# EAGLE design HELPStat_V2 (EAGLE 9.6.2)
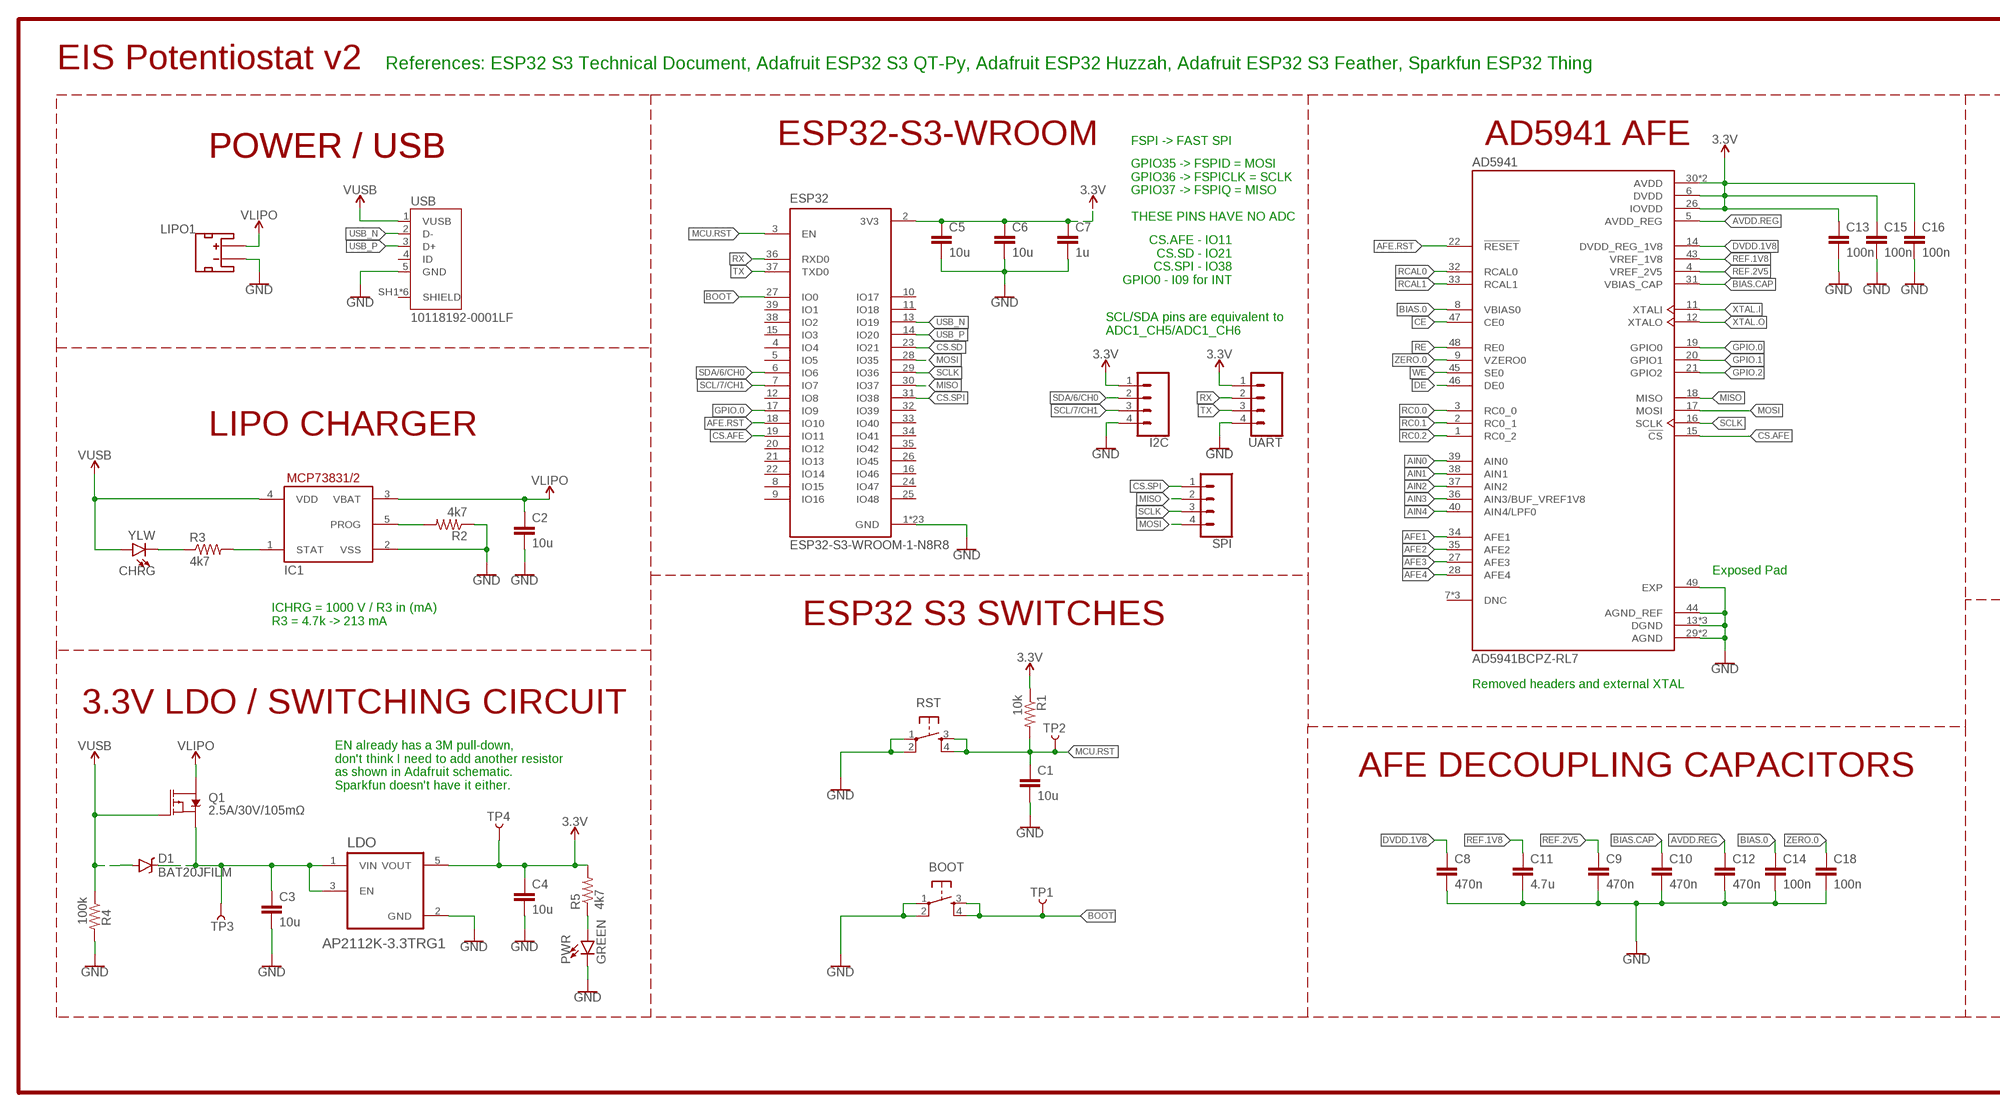
[diagram p0: schematic, sheet 1, part 1 of 2]
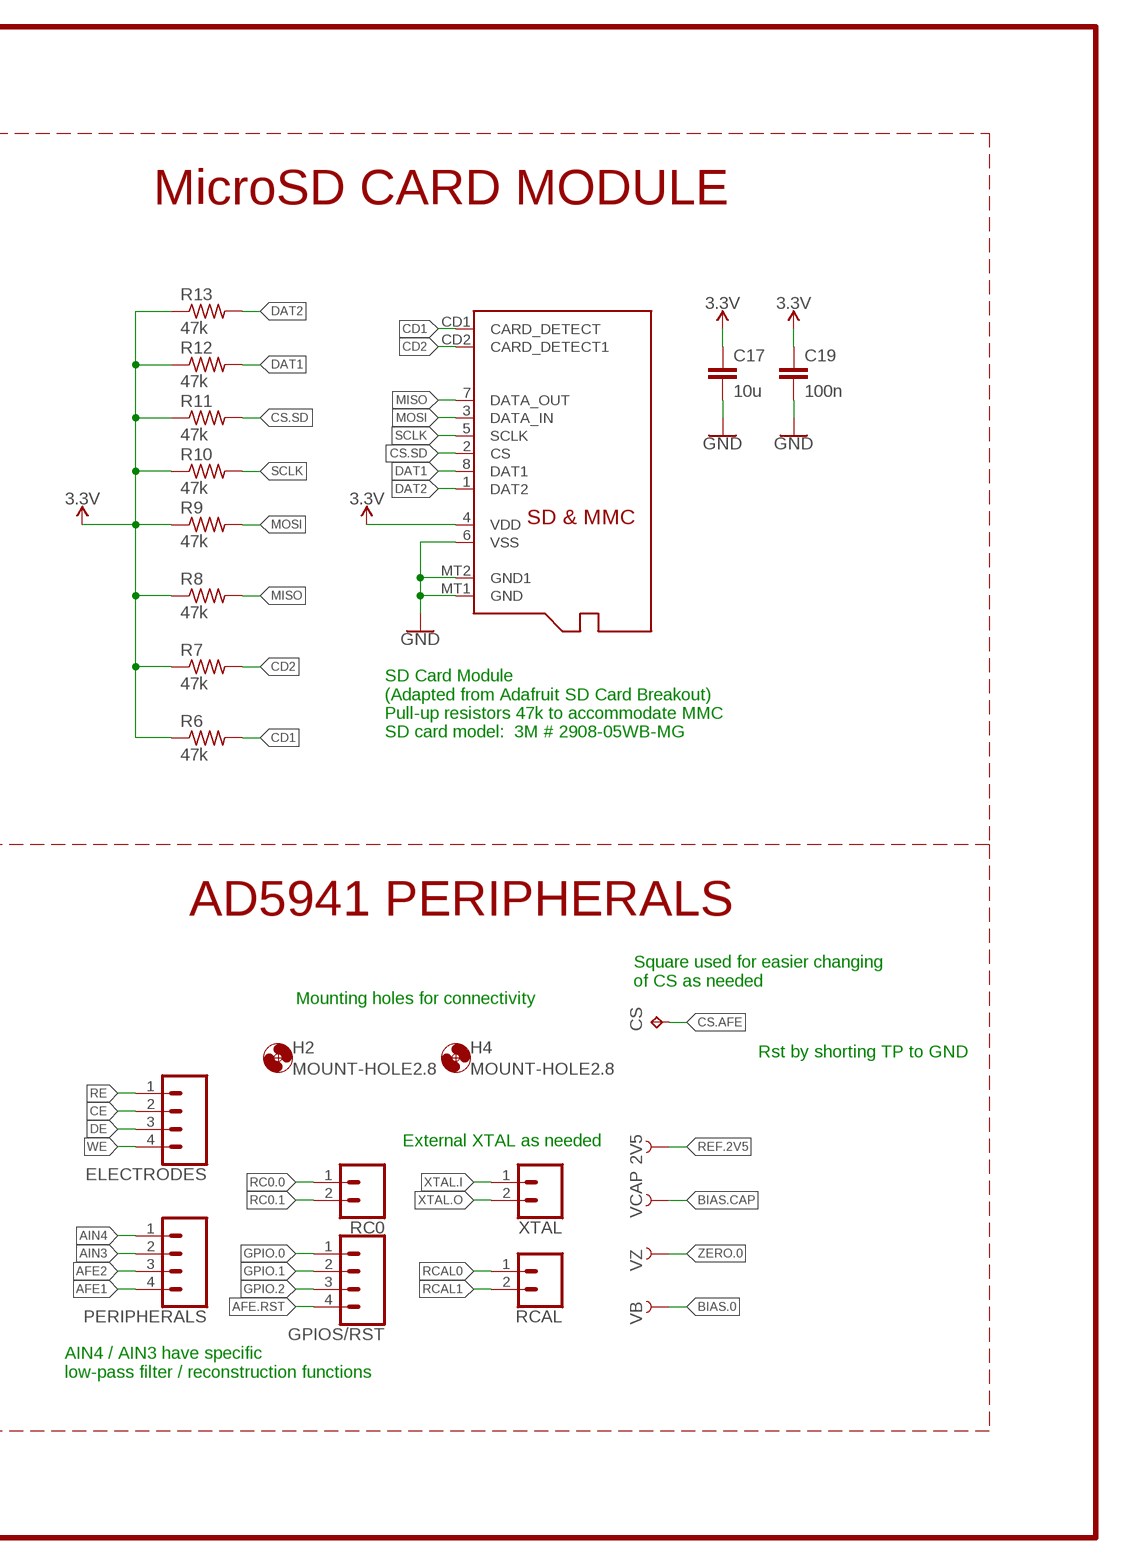
[diagram p1: schematic, sheet 1, part 2 of 2]

## Parts
2V5  TEST-POINT3X5  [PAD.03X.05]
AD5941  AD5941BCPZ-RL7  [QFN50P700X700X80-49N]
BOOT  SPST-PTS830GG140  [BUTTON-GULLWING]
C1  10u  CAPACITOR0402  [C0402]
C2  10u  CAPACITOR0402  [C0402]
C3  10u  CAPACITOR0402  [C0402]
C4  10u  CAPACITOR0402  [C0402]
C5  10u  CAPACITOR0402  [C0402]
C6  10u  CAPACITOR0402  [C0402]
C7  1u  CAPACITOR0402  [C0402]
C8  470n  CAPACITOR0402  [C0402]
C9  470n  CAPACITOR0402  [C0402]
C10  470n  CAPACITOR0402  [C0402]
C11  4.7u  CAPACITOR0402  [C0402]
C12  470n  CAPACITOR0402  [C0402]
C13  100n  CAPACITOR0402  [C0402]
C14  100n  CAPACITOR0402  [C0402]
C15  100n  CAPACITOR0402  [C0402]
C16  100n  CAPACITOR0402  [C0402]
C17  10u  CAPACITOR0402  [C0402]
C18  100n  CAPACITOR0402  [C0402]
C19  100n  CAPACITOR0402  [C0402]
CHRG  YLW  LED0603  [LED-0603]
CS  TPTP20SQ  [TP20SQ]
D1  BAT20JFILM  [SOD-323]
ELECTRODES  CONN_04  [1X04]
ESP32  ESP32-S3-WROOM-1-N8R8  [XCVR_ESP32S3WROOM1N8R8]
GPIOS/RST  CONN_041.27MM  [1X04_1.27MM]
H2  MOUNT-HOLE2.8  [2,8]
H4  MOUNT-HOLE2.8  [2,8]
I2C  CONN_04  [1X04]
IC1  MCP73831/OT  [SOT23-5L]
LDO  AP2112K-3.3TRG1  [SOT95P285X140-5N]
LIPO1  JST_2MM_MALE  [JST-2-SMD]
PERIPHERALS  CONN_041.27MM  [1X04_1.27MM]
PWR  GREEN  LED0603  [LED-0603]
Q1  2.5A/30V/105mΩ  PFET-DMG2307L  [SOT23-3]
R1  10k  RESISTOR0402  [R0402]
R2  4k7  RESISTOR0402  [R0402]
R3  4k7  RESISTOR0402  [R0402]
R4  100k  RESISTOR0603  [R0603]
R5  4k7  RESISTOR0402  [R0402]
R6  47k  RESISTOR0402  [R0402]
R7  47k  RESISTOR0402  [R0402]
R8  47k  RESISTOR0402  [R0402]
R9  47k  RESISTOR0402  [R0402]
R10  47k  RESISTOR0402  [R0402]
R11  47k  RESISTOR0402  [R0402]
R12  47k  RESISTOR0402  [R0402]
R13  47k  RESISTOR0402  [R0402]
RC0  CONN_02.50MIL  [1X02_1.27MM]
RCAL  CONN_02  [1X02]
RST  SPST-PTS830GG140  [BUTTON-GULLWING]
SDCARD  MICROSD  [MICROSD]
SPI  CONN_04  [1X04]
TP1  TEST-POINT3X5  [PAD.03X.05]
TP2  TEST-POINT3X5  [PAD.03X.05]
TP3  TEST-POINT3X5  [PAD.03X.05]
TP4  TEST-POINT3X5  [PAD.03X.05]
UART  CONN_04  [1X04]
USB  10118192-0001LF  [AMPHENOL_10118192-0001LF]
VB  TEST-POINT3X5  [PAD.03X.05]
VCAP  TEST-POINT3X5  [PAD.03X.05]
VZ  TEST-POINT3X5  [PAD.03X.05]
XTAL  CONN_02.50MIL  [1X02_1.27MM]

## Nets
3.3V: AD5941.6(DVDD) AD5941.26(IOVDD) AD5941.30(AVDD) AD5941.41(AVDD) C4.1 C5.1 C6.1 C7.1 C13.1 C15.1 C16.1 C17.1 C19.1 ESP32.2(3V3) I2C.1 LDO.5(VOUT) R1.1 R5.2 R6.1 R7.1 R8.1 R9.1 R10.1 R11.1 R12.1 R13.1 SDCARD.4(VDD) TP4.P$1 UART.1
AFE1: AD5941.34(AFE1) PERIPHERALS.4
AFE2: AD5941.35(AFE2) PERIPHERALS.3
AFE3: AD5941.27(AFE3)
AFE4: AD5941.28(AFE4)
AFE.RST: AD5941.22(!RESET) ESP32.18(IO10) GPIOS/RST.4
AIN0: AD5941.39(AIN0)
AIN1: AD5941.38(AIN1)
AIN2: AD5941.37(AIN2)
AIN3: AD5941.36(AIN3/BUF_VREF1V8) PERIPHERALS.2
AIN4: AD5941.40(AIN4/LPF0) PERIPHERALS.1
AVDD.REG: AD5941.5(AVDD_REG) C12.1
BIAS.0: AD5941.8(VBIAS0) C14.1 VB.P$1
BIAS.CAP: AD5941.31(VBIAS_CAP) C10.1 VCAP.P$1
BOOT: BOOT.3 BOOT.4 ESP32.27(IO0) TP1.P$1
CD1: R6.2 SDCARD.CD1(CARD_DETECT)
CD2: R7.2 SDCARD.CD2(CARD_DETECT1)
CE: AD5941.47(CE0) ELECTRODES.2
CS.AFE: AD5941.15(!CS) CS.TP ESP32.19(IO11)
CS.SD: ESP32.23(IO21) R11.2 SDCARD.2(CS)
CS.SPI: ESP32.31(IO38) SPI.1
DAT1: R12.2 SDCARD.8(DAT1)
DAT2: R13.2 SDCARD.1(DAT2)
DE: AD5941.46(DE0) ELECTRODES.3
DVDD.1V8: AD5941.14(DVDD_REG_1V8) C8.1
GND: AD5941.13(DGND) AD5941.23(DGND) AD5941.25(DGND) AD5941.29(AGND) AD5941.42(AGND) AD5941.44(AGND_REF) AD5941.49(EXP) BOOT.1 BOOT.2 C1.2 C2.2 C3.2 C4.2 C5.2 C6.2 C7.2 C8.2 C9.2 C10.2 C11.2 C12.2 C13.2 C14.2 C15.2 C16.2 C17.2 C18.2 C19.2 ESP32.1(GND) ESP32.40(GND) ESP32.41_1(GND) ESP32.41_2(GND) ESP32.41_3(GND) ESP32.41_4(GND) ESP32.41_5(GND) ESP32.41_6(GND) ESP32.41_7(GND) ESP32.41_8(GND) ESP32.41_9(GND) ESP32.41_10(GND) ESP32.41_11(GND) ESP32.41_12(GND) ESP32.41_13(GND) ESP32.41_14(GND) ESP32.41_15(GND) ESP32.41_16(GND) ESP32.41_17(GND) ESP32.41_18(GND) ESP32.41_19(GND) ESP32.41_20(GND) ESP32.41_21(GND) I2C.4 IC1.2(VSS) LDO.2(GND) LIPO1.1(-) PWR.C R2.1 R4.2 RST.1 RST.2 SDCARD.6(VSS) SDCARD.MT1(GND) SDCARD.MT2(GND1) UART.4 USB.5(GND)
GPIO.0: AD5941.19(GPIO0) ESP32.17(IO9) GPIOS/RST.1
GPIO.1: AD5941.20(GPIO1) GPIOS/RST.2
GPIO.2: AD5941.21(GPIO2) GPIOS/RST.3
MCU.RST: C1.1 ESP32.3(EN) R1.2 RST.3 RST.4 TP2.P$1
MISO: AD5941.18(MISO) ESP32.30(IO37) R8.2 SDCARD.7(DATA_OUT) SPI.2
MOSI: AD5941.17(MOSI) ESP32.28(IO35) R9.2 SDCARD.3(DATA_IN) SPI.4
N$1: CHRG.C R3.1
N$2: IC1.1(STAT) R3.2
N$3: IC1.5(PROG) R2.2
N$4: PWR.A R5.1
N$7: C3.1 D1.C LDO.1(VIN) LDO.3(EN) Q1.2(S) TP3.P$1
RC0.0: AD5941.3(RC0_0) RC0.1
RC0.1: AD5941.2(RC0_1) RC0.2
RC0.2: AD5941.1(RC0_2)
RCAL0: AD5941.32(RCAL0) RCAL.1
RCAL1: AD5941.33(RCAL1) RCAL.2
RE: AD5941.48(RE0) ELECTRODES.1
REF.1V8: AD5941.43(VREF_1V8) C11.1
REF.2V5: 2V5.P$1 AD5941.4(VREF_2V5) C9.1
RX: ESP32.36(RXD0) UART.2
SCL/7/CH1: ESP32.7(IO7) I2C.3
SCLK: AD5941.16(SCLK) ESP32.29(IO36) R10.2 SDCARD.5(SCLK) SPI.3
SDA/6/CH0: ESP32.6(IO6) I2C.2
TX: ESP32.37(TXD0) UART.3
USB_N: ESP32.13(IO19) USB.2(D-)
USB_P: ESP32.14(IO20) USB.3(D+)
V_USB: CHRG.A D1.A IC1.4(VDD) Q1.1(G) R4.1 USB.1(VUSB) ; supply symbol labelled VUSB
VLIPO: C2.1 IC1.3(VBAT) LIPO1.2(+) Q1.3(D)
WE: AD5941.45(SE0) ELECTRODES.4
XTAL.I: AD5941.11(XTALI) XTAL.1
XTAL.O: AD5941.12(XTALO) XTAL.2
ZERO.0: AD5941.9(VZERO0) C18.1 VZ.P$1
Unconnected: AD5941.7(DNC) AD5941.10(DNC) AD5941.24(DNC) ESP32.4(IO4) ESP32.5(IO5) ESP32.8(IO15) ESP32.9(IO16) ESP32.10(IO17) ESP32.11(IO18) ESP32.12(IO8) ESP32.15(IO3) ESP32.16(IO46) ESP32.20(IO12) ESP32.21(IO13) ESP32.22(IO14) ESP32.24(IO47) ESP32.25(IO48) ESP32.26(IO45) ESP32.32(IO39) ESP32.33(IO40) ESP32.34(IO41) ESP32.35(IO42) ESP32.38(IO2) ESP32.39(IO1) LIPO1.NC1(PAD1) LIPO1.NC2(PAD2) USB.4(ID) USB.SH1(SHIELD) USB.SH2(SHIELD) USB.SH3(SHIELD) USB.SH4(SHIELD) USB.SH5(SHIELD) USB.SH6(SHIELD)

## Notes on the sheet
- EIS Potentiostat v2 | References: ESP32 S3 Technical Document, Adafruit ESP32 S3 QT-Py, Adafruit ESP32 Huzzah, Adafruit ESP32 S3 Feather, Sparkfun ESP32 Thing
- ESP32-S3-WROOM | FSPI -> FAST SPI | AD5941 AFE | MicroSD CARD MODULE
- POWER / USB | POWER / USB
- GPIO35 -> FSPID = MOSI
  GPIO36 -> FSPICLK = SCLK
  GPIO37 -> FSPIQ = MISO
  
  THESE PINS HAVE NO ADC
- CS.AFE - IO11
  CS.SD - IO21
  CS.SPI - IO38
  GPIO0 - I09 for INT
- SCL/SDA pins are equivalent to 
  ADC1_CH5/ADC1_CH6
- LIPO CHARGER
- SD Card Module
  (Adapted from Adafruit SD Card Breakout)
  Pull-up resistors 47k to accommodate MMC
  SD card model:  3M # 2908-05WB-MG
- Exposed Pad
- ICHRG = 1000 V / R3 in (mA)
  R3 = 4.7k -> 213 mA
- ESP32 S3 SWITCHES
- AD5941 PERIPHERALS
- Removed headers and external XTAL
- Square used for easier changing
  of CS as needed
- 3.3V LDO / SWITCHING CIRCUIT | Mounting holes for connectivity
- Rst by shorting TP to GND
- AFE DECOUPLING CAPACITORS
- EN already has a 3M pull-down,
  don't think I need to add another resistor
  as shown in Adafruit schematic.
  Sparkfun doesn't have it either.
- External XTAL as needed
- AIN4 / AIN3 have specific
  low-pass filter / reconstruction functions

## Library data of the parts
2V5 TP1-TP4 VB VCAP VZ = LinnesLab-Connectors:TEST-POINT: SparkFun Test Points Bare copper test points for troubleshooting or In-Circuit-Testing. These are used by our Production team for verifying production board runs using pogo-pins on test beds. SparkFun Products: SparkFun LSM9DS1 Breakout <https://www.sparkfun.com/products/13284> SparkFun PSOC <https://www.sparkfun.com/products/13714> SparkFun Load Cell Amplifier <https://www.sparkfun.com/products/13879>
AD5941 = AD5941BCPZ-RL7:AD5941BCPZ-RL7: Check availability <https://pricing.snapeda.com/parts/AD5941BCPZ-RL7/Analog%20Devices/view-part?ref=eda>; AVAILABILITY: In Stock; DESCRIPTION: High Precision, Impedance & Electrochemical Front End; MF: Analog Devices; MP: AD5941BCPZ-RL7; PACKAGE: LFCSP -48 Analog Devices; PRICE: None; PURCHASE-URL: https://pricing.snapeda.com/search/part/AD5941BCPZ-RL7/?ref=eda
BOOT RST = LinnesLab-Switches:SPST-PTS830GG140
C1-C19 = LinnesLab-Passives:CAPACITOR
CHRG PWR = LinnesLab-LED:LED: LED (Generic) Standard schematic elements and footprints for 5mm, 3mm, 1206, and 0603 sized LEDs. Generic LEDs with no color specified. LTST-C190KGKT: arrow indicates cathode
CS = testpad:TP: Test pad
D1 = BAT20JFILM:BAT20JFILM: 23V, 1A Schottky diode, SOD-323 package Check availability <https://pricing.snapeda.com/parts/BAT20JFILM/STMicroelectronics/view-part?ref=eda>; AVAILABILITY: In Stock; DESCRIPTION: Diode Schottky 23 V 1A Surface Mount SOD-323; MF: STMicroelectronics; MP: BAT20JFILM; PACKAGE: SOD-323 STMicroelectronics; PRICE: None; PURCHASE-URL: https://pricing.snapeda.com/search/part/BAT20JFILM/?ref=eda
ELECTRODES I2C SPI UART = LinnesLab-Connectors:CONN_04: Multi connection point. Often used as Generic Header-pin footprint for 0.1 inch spaced/style header connections On any of the 0.1 inch spaced packages, you can populate with these: Break Away Headers - Straight <https://www.sparkfun.com/products/116> (PRT-00116) Break Away Male Headers - Right Angle <https://www.sparkfun.com/products/553> (PRT-00553) Female Headers <https://www.sparkfun.com/products/115> (PRT-00115) Break Away Headers - Machine Pin <https://www.sparkfun.com/products/117> (PRT-00117) Break Away Female Headers - Swiss Machine Pin <https://www.sparkfun.com/products/743> (PRT-00743) For SCREWTERMINALS and SPRING TERMINALS visit here: Screw Terimnals on SparkFun.com <https://www.sparkfun.com/search/results?term=Screw+Terminals> (5mm/3.5mm/2.54mm spacing) This device is also useful as a general connection point to wire up your design to another part of your project. Our various solder wires solder well into these plated through hole pads. Hook-Up Wire - Assortment (Stranded, 22 AWG) <https://www.sparkfun.com/products/11375> (PRT-11375) Hook-Up Wire - Assortment (Solid Core, 22 AWG) <https://www.sparkfun.com/products/11367> (PRT-11367) View the entire wire category on our website here <https://www.sparkfun.com/categories/141> Special notes: Molex polarized connector foot print use with SKU : PRT-08231 with associated crimp pins and housings. 1MM SMD Version SKU: PRT-10208; PROD_ID: CONN-09696
ESP32 = ESP32-S3-WROOM-1-N8R8:ESP32-S3-WROOM-1-N8R8: Check availability <https://pricing.snapeda.com/parts/ESP32S3WROOM1N8R8/Espressif%20Systems/view-part?ref=eda>; CHECK_PRICES: https://www.snapeda.com/parts/ESP32-S3-WROOM-1-N8R8/Espressif+Systems/view-part/?ref=eda; DESCRIPTION: Bluetooth, WiFi 802.11b/g/n, Bluetooth v5.0 Transceiver Module 2.4GHz PCB Trace Surface Mount; DIGIKEY_PART_NUMBER: 1965-ESP32-S3-WROOM-1-N8R8CT-ND; MF: Espressif Systems; MP: ESP32-S3-WROOM-1-N8R8; PACKAGE: NON STANDARD Espressif Systems; PURCHASE-URL: https://www.snapeda.com/api/url_track_click_mouser/?unipart_id=8936581&manufacturer=Espressif Systems&part_name=ESP32-S3-WROOM-1-N8R8&search_term=esp32-s3-wroom-1-n8; SNAPEDA_LINK: https://www.snapeda.com/parts/ESP32-S3-WROOM-1-N8R8/Espressif+Systems/view-part/?ref=snap
GPIOS/RST PERIPHERALS = LinnesLab-Connectors:CONN_04: Multi connection point. Often used as Generic Header-pin footprint for 0.1 inch spaced/style header connections On any of the 0.1 inch spaced packages, you can populate with these: Break Away Headers - Straight <https://www.sparkfun.com/products/116> (PRT-00116) Break Away Male Headers - Right Angle <https://www.sparkfun.com/products/553> (PRT-00553) Female Headers <https://www.sparkfun.com/products/115> (PRT-00115) Break Away Headers - Machine Pin <https://www.sparkfun.com/products/117> (PRT-00117) Break Away Female Headers - Swiss Machine Pin <https://www.sparkfun.com/products/743> (PRT-00743) For SCREWTERMINALS and SPRING TERMINALS visit here: Screw Terimnals on SparkFun.com <https://www.sparkfun.com/search/results?term=Screw+Terminals> (5mm/3.5mm/2.54mm spacing) This device is also useful as a general connection point to wire up your design to another part of your project. Our various solder wires solder well into these plated through hole pads. Hook-Up Wire - Assortment (Stranded, 22 AWG) <https://www.sparkfun.com/products/11375> (PRT-11375) Hook-Up Wire - Assortment (Solid Core, 22 AWG) <https://www.sparkfun.com/products/11367> (PRT-11367) View the entire wire category on our website here <https://www.sparkfun.com/categories/141> Special notes: Molex polarized connector foot print use with SKU : PRT-08231 with associated crimp pins and housings. 1MM SMD Version SKU: PRT-10208
H2 H4 = holes:MOUNT-HOLE: MOUNTING HOLE with drill center marker
IC1 = adafruit:MCP73831: MCP73831/2 Miniature Single-Cell, Fully Integrated Li-Ion, Li-Polymer Charge Management Controllers. Nice and small simple lipoly charge controller, with adjustable current and status output (LED) http://www.ladyada.net/library/pcb/eaglelibrary.html
LDO = AP2112K-3.3TRG1:AP2112K-3.3TRG1: AP2112 Series 0.6 A 3.3 V Fixed Output SMT LDO Linear Regulator - SOT23-5 Check availability <https://pricing.snapeda.com/parts/AP2112K-3.3TRG1/Diodes%20Inc./view-part?ref=eda>; AVAILABILITY: In Stock; DESCRIPTION: Linear Voltage Regulator IC Positive Fixed 1 Output 600mA SOT-25; MF: Diodes Inc.; MP: AP2112K-3.3TRG1; PACKAGE: SOT-753 Diodes Inc.; PRICE: None; PURCHASE-URL: https://pricing.snapeda.com/search/part/AP2112K-3.3TRG1/?ref=eda
LIPO1 = LinnesLab-Connectors:JST_2MM_MALE: JST 2MM MALE RA CONNECTOR Two pin, compact surface mount connector. Commonly used as a battery input connection point. We really like the solid locking feeling and high current rating on these small connectors. We use these all the time as battery connectors. Mates to single-cell LiPo batteries. Here is the connector we sell at SparkFun: JST Right Angle Connector - White <https://www.sparkfun.com/products/8612> (PRT-08612) Datasheet <http://www.sparkfun.com/datasheets/Prototyping/Connectors/JST-Horizontal.pdf> It was used on these SparkFun products: SparkFun MOSFET Power Controller <https://www.sparkfun.com/products/11214> (PRT-11214) SparkFun Battery Babysitter - LiPo Battery Manager <https://www.sparkfun.com/products/13777> (PRT-13777) And many, many others that required a lipo battery connection.; PROD_ID: CONN-11443; SF_ID: PRT-08612
Q1 = LinnesLab-DiscreteSemi:PFET: P-channel MOSFETs Voltage controlled devices that allow control of high current outputs. SparkFun Products: SparkFun ESP32 Thing <https://www.sparkfun.com/products/13907> SparkFun ESP8266 Thing <https://www.sparkfun.com/products/13231>; PROD_ID: TRANS-11308
R1-R13 = LinnesLab-Passives:RESISTOR
RC0 RCAL XTAL = LinnesLab-Connectors:CONN_02: Multi connection point. Often used as Generic Header-pin footprint for 0.1 inch spaced/style header connections On any of the 0.1 inch spaced packages, you can populate with these: Break Away Headers - Straight <https://www.sparkfun.com/products/116> (PRT-00116) Break Away Male Headers - Right Angle <https://www.sparkfun.com/products/553> (PRT-00553) Female Headers <https://www.sparkfun.com/products/115> (PRT-00115) Break Away Headers - Machine Pin <https://www.sparkfun.com/products/117> (PRT-00117) Break Away Female Headers - Swiss Machine Pin <https://www.sparkfun.com/products/743> (PRT-00743) For SCREWTERMINALS and SPRING TERMINALS visit here: Screw Terimnals on SparkFun.com <https://www.sparkfun.com/search/results?term=Screw+Terminals> (5mm/3.5mm/2.54mm spacing) This device is also useful as a general connection point to wire up your design to another part of your project. Our various solder wires solder well into these plated through hole pads. Hook-Up Wire - Assortment (Stranded, 22 AWG) <https://www.sparkfun.com/products/11375> (PRT-11375) Hook-Up Wire - Assortment (Solid Core, 22 AWG) <https://www.sparkfun.com/products/11367> (PRT-11367) View the entire wire category on our website here <https://www.sparkfun.com/categories/141> Special notes: Molex polarized connector foot print use with: PRT-08233 with associated crimp pins and housings. 2.54_SCREWTERM for use with PRT-10571. 3.5mm Screw Terminal footprints for PRT-08084 5mm Screw Terminal footprints for use with PRT-08432
SDCARD = adafruit:MICROSD: Micro-SD / Transflash card holder with SPI pinout For the 3M # 2908-05WB-MG and/or 4UCON #19656 push-push type
USB = USB_MicroB:10118192-0001LF: Single Port 5 Contact Horizontal Right Angle Shielded Micro B USB 2.0 Connector Check availability <https://pricing.snapeda.com/parts/10118192-0001LF/Amphenol%20ICC/view-part?ref=eda>; AVAILABILITY: In Stock; DESCRIPTION: Micro USB, Input Output Connectors, B TYPE RECEPTACLE with flange; MF: Amphenol ICC; MP: 10118192-0001LF; PACKAGE: None; PRICE: None; PURCHASE-URL: https://pricing.snapeda.com/search/part/10118192-0001LF/?ref=eda

## Board
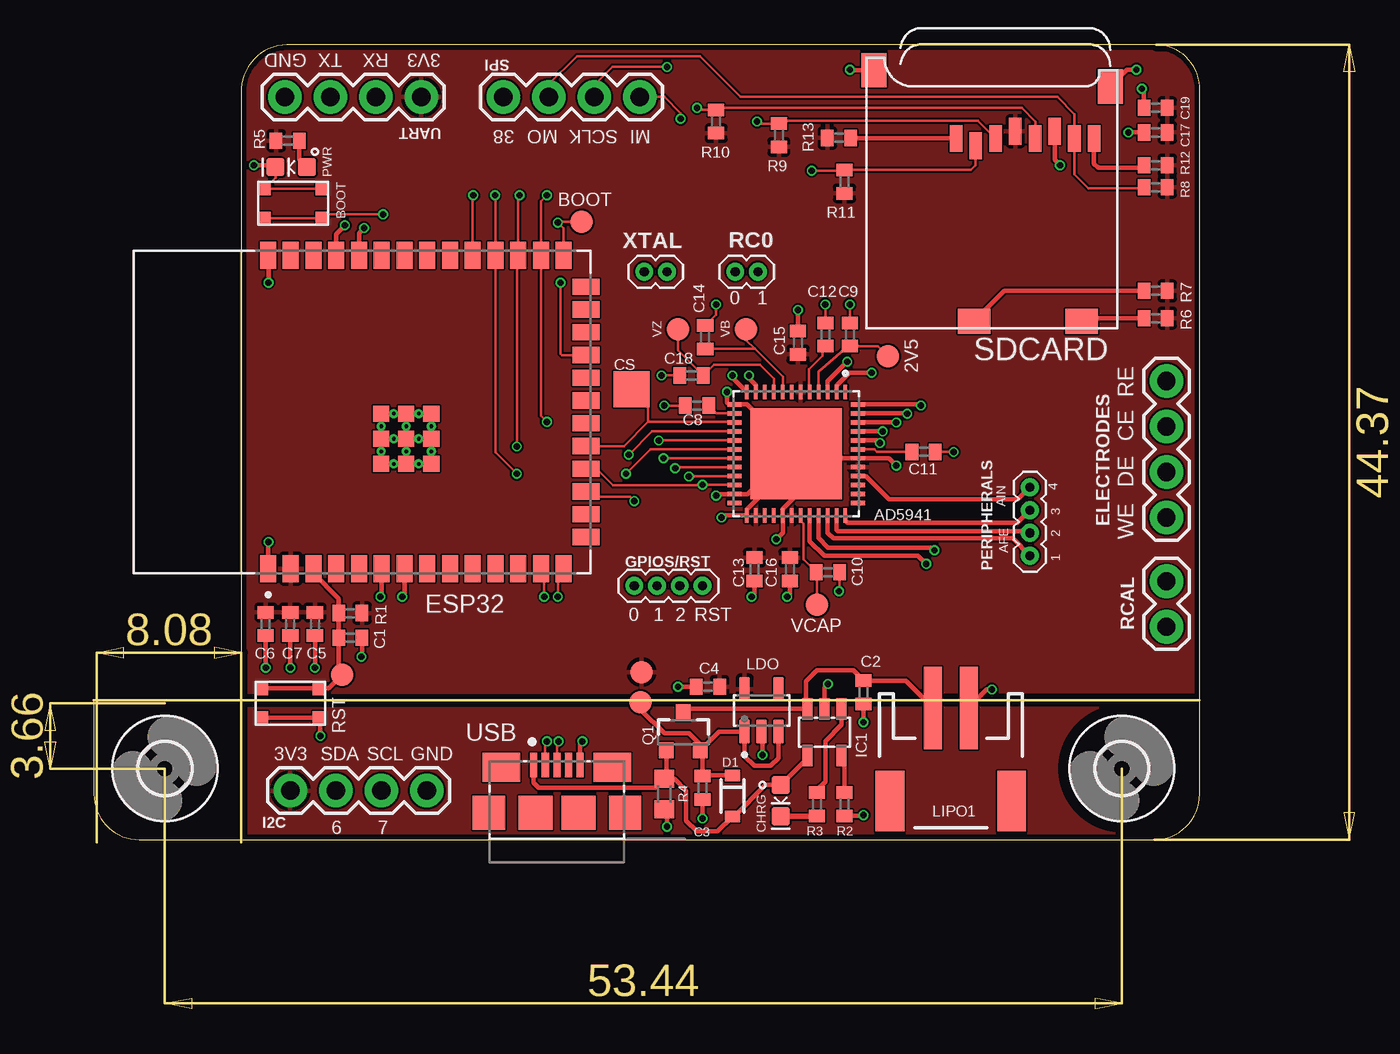
[diagram p2: board, top side]
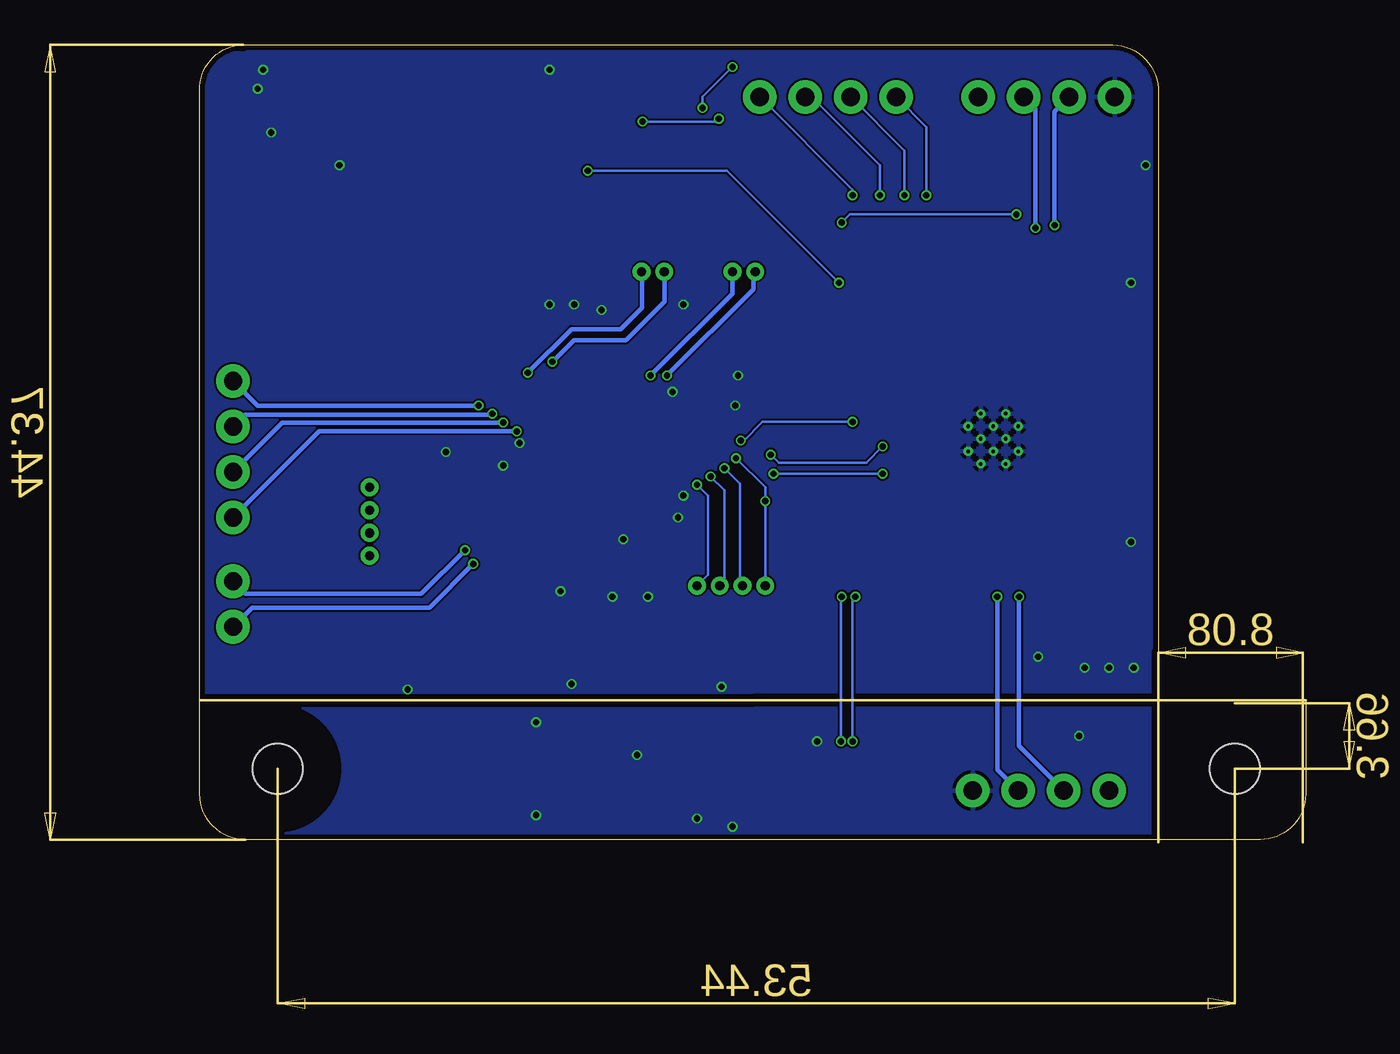
[diagram p3: board, bottom side, seen from below]

Size 61.75 x 44.37 mm. Coordinates in mm from the lower left corner, seen from the top.
Outline: 0,7.77 0,2.54 arc90 2.54,0 59.21,0 arc90 61.75,2.53 61.75,41.82 arc90 59.34,44.37 10.76,44.37 arc90 8.23,41.69 8.23,7.77 0,7.77
Copper layers (1*16): Top 0.035mm / dielectric 1.5mm / Bottom 0.035mm
Design rules "PCBWay_2L_100um-Track": minimum track width 0.1mm, minimum drill 0.3mm, track to track 0.1mm, track to pad 0.1mm, pad to pad 0.1mm, via to via 0.1mm, smd to smd 0mil, copper to edge 0.3mm, drill to drill 10mil, minimum pad ring 6mil, minimum via ring 0.1mm, stop-mask expansion 2mil, vias tented up to drill 0.45mm, thermal gap 0.2mm

### Footprints (pad centres in the part's own frame; a part is rotated, then mirrored left to right if it is on the bottom)
PAD.03X.05 = smd 1.27 x 1.27: P$1 0,0
QFN50P700X700X80-49N = smd 0.84 x 0.26: 1 -3.445,2.75; 2 -3.445,2.25; 3 -3.445,1.75; 4 -3.445,1.25; 5 -3.445,0.75; 6 -3.445,0.25; 7 -3.445,-0.25; 8 -3.445,-0.75; 9 -3.445,-1.25; 10 -3.445,-1.75; 11 -3.445,-2.25; 12 -3.445,-2.75; 25 3.445,-2.75; 26 3.445,-2.25; 27 3.445,-1.75; 28 3.445,-1.25; 29 3.445,-0.75; 30 3.445,-0.25; 31 3.445,0.25; 32 3.445,0.75; 33 3.445,1.25; 34 3.445,1.75; 35 3.445,2.25; 36 3.445,2.75 | smd 0.26 x 0.84: 13 -2.75,-3.445; 14 -2.25,-3.445; 15 -1.75,-3.445; 16 -1.25,-3.445; 17 -0.75,-3.445; 18 -0.25,-3.445; 19 0.25,-3.445; 20 0.75,-3.445; 21 1.25,-3.445; 22 1.75,-3.445; 23 2.25,-3.445; 24 2.75,-3.445; 37 2.75,3.445; 38 2.25,3.445; 39 1.75,3.445; 40 1.25,3.445; 41 0.75,3.445; 42 0.25,3.445; 43 -0.25,3.445; 44 -0.75,3.445; 45 -1.25,3.445; 46 -1.75,3.445; 47 -2.25,3.445; 48 -2.75,3.445 | smd 5.1 x 5.1: 49 0,0
BUTTON-GULLWING = smd 0.7 x 0.75: 1 -1.6,0.825; 2 1.6,0.825; 3 -1.6,-0.825; 4 1.6,-0.825
C0402 = smd 0.7 x 0.9: 1 -0.65,0; 2 0.65,0
LED-0603 = smd 1 x 1: A -0.877,0; C 0.877,0
TP20SQ = smd 2 x 2: TP 0,0
SOD-323 = smd 0.63 x 0.83: A 1.15,0; C -1.15,0
1X04 = drill 1.016 pad 1.88: 1 0,0; 2 2.54,0; 3 5.08,0; 4 7.62,0
XCVR_ESP32S3WROOM1N8R8 = smd 1.5 x 0.9: 1 -8.75,5.26; 2 -8.75,3.99; 3 -8.75,2.72; 4 -8.75,1.45; 5 -8.75,0.18; 6 -8.75,-1.09; 7 -8.75,-2.36; 8 -8.75,-3.63; 9 -8.75,-4.9; 10 -8.75,-6.17; 11 -8.75,-7.44; 12 -8.75,-8.71; 13 -8.75,-9.98; 14 -8.75,-11.25; 27 8.75,-11.25; 28 8.75,-9.98; 29 8.75,-8.71; 30 8.75,-7.44; 31 8.75,-6.17; 32 8.75,-4.9; 33 8.75,-3.63; 34 8.75,-2.36; 35 8.75,-1.09; 36 8.75,0.18; 37 8.75,1.45; 38 8.75,2.72; 39 8.75,3.99; 40 8.75,5.26 | smd 0.9 x 1.5: 15 -6.985,-12.5; 16 -5.715,-12.5; 17 -4.445,-12.5; 18 -3.175,-12.5; 19 -1.905,-12.5; 20 -0.635,-12.5; 21 0.635,-12.5; 22 1.905,-12.5; 23 3.175,-12.5; 24 4.445,-12.5; 25 5.715,-12.5; 26 6.985,-12.5 | smd 0.9 x 0.9: 41_1 -1.5,-2.46; 41_2 -2.9,-2.46; 41_3 -0.1,-2.46; 41_4 -2.9,-3.86; 41_5 -1.5,-3.86; 41_6 -0.1,-3.86; 41_7 -2.9,-1.06; 41_8 -1.5,-1.06; 41_9 -0.1,-1.06 | drill 0.2 pad 0.4: 41_10 -1.5,-1.76; 41_11 -2.9,-1.76; 41_12 -0.1,-1.76; 41_13 -2.9,-3.16; 41_14 -1.5,-3.16; 41_15 -0.1,-3.16; 41_16 -2.2,-1.06; 41_17 -0.8,-1.06; 41_18 -2.2,-2.46; 41_19 -0.8,-2.46; 41_20 -2.2,-3.86; 41_21 -0.8,-3.86
1X04_1.27MM = drill 0.508 pad 1: 1 0,0; 2 1.27,0; 3 2.54,0; 4 3.81,0
2,8 = hole 2.8: 0,0
SOT23-5L = smd 0.55 x 1.2: 1 -0.95,-1.3; 2 0,-1.3; 3 0.95,-1.3; 4 0.95,1.3; 5 -0.95,1.3
SOT95P285X140-5N = smd 1.35 x 0.6: 1 -1.185,0.95; 2 -1.185,0; 3 -1.185,-0.95; 4 1.185,-0.95; 5 1.185,0.95
JST-2-SMD = smd 1 x 4.6: 1 -1,-3.7; 2 1,-3.7 | smd 1.6 x 3.4: NC1 -3.4,1.5; NC2 3.4,1.5
SOT23-3 = smd 0.8 x 0.9: 1 -0.95,-1; 2 0.95,-1; 3 0,1.1
R0402 = smd 0.7 x 0.9: 1 -0.65,0; 2 0.65,0
R0603 = smd 1 x 1.1: 1 -0.85,0; 2 0.85,0
1X02_1.27MM = drill 0.508 pad 1: 1 0,0; 2 1.27,0
1X02 = drill 1.016 pad 1.88: 1 0,0; 2 2.54,0
MICROSD = smd 0.7 x 1.5: 1 9,-10.64; 2 7.9,-10.24; 3 6.8,-10.64; 4 5.7,-11.04; 5 4.6,-10.64; 6 3.5,-11.04; 7 2.4,-10.64; 8 1.3,-10.64 | smd 1.8 x 1.4: CD1 2,-0.44; CD2 8,-0.44 | smd 1.4 x 1.9: MT1 0.4,-13.54; MT2 13.6,-14.44
AMPHENOL_10118192-0001LF = smd 0.4 x 1.35: 1 -1.3,0; 2 -0.65,0; 3 0,0; 4 0.65,0; 5 1.3,0 | smd 2.1 x 1.6: SH1 -3.1,-0.125; SH2 3.1,-0.125 | smd 1.8 x 1.9: SH3 -3.8,-2.675; SH6 3.8,-2.675 | smd 1.9 x 1.9: SH4 -1.2,-2.675; SH5 1.2,-2.675

### Placement (x,y rotation side)
2V5  44.35,26.97 0 top
AD5941  39.22,21.54 270 top
BOOT  11.13,35.51 0 top
C1  14.33,11.28 0 top
C2  42.98,8.23 270 top
C3  33.99,2.9 270 top
C4  34.29,8.53 180 top
C5  12.34,12.04 270 top
C6  9.6,12.04 270 top
C7  10.97,12.04 270 top
C8  33.68,24.23 180 top
C9  42.21,28.19 90 top
C10  41,14.94 0 top
C11  46.33,21.64 0 top
C12  40.84,28.19 90 top
C13  36.88,15.09 270 top
C14  34.14,28.04 90 top
C15  39.32,27.74 90 top
C16  38.86,15.09 270 top
C17  59.28,39.47 180 top
C18  33.38,25.91 180 top
C19  59.28,40.84 180 top
CHRG  38.35,2.18 270 top
CS  30.02,25.15 0 top
D1  35.66,2.44 270 top
ELECTRODES  59.89,25.6 270 top
ESP32  14.99,23.88 90 top
GPIOS/RST  30.18,14.17 0 top
H2  3.96,3.96 0 top
H4  57.4,3.96 0 top
I2C  10.97,2.74 0 top
IC1  40.79,5.99 180 top
LDO  37.29,7.21 90 top
LIPO1  47.85,3.66 180 top
PERIPHERALS  52.27,19.66 270 top
PWR  11.02,37.54 180 top
Q1  32.92,5.99 0 top
R1  14.33,12.65 180 top
R2  41.91,1.98 90 top
R3  40.39,1.98 90 top
R4  31.85,2.54 270 top
R5  10.82,39.01 180 top
R6  59.28,29.11 180 top
R7  59.28,30.63 180 top
R8  59.28,36.42 180 top
R9  38.25,39.32 90 top
R10  34.75,40.08 90 top
R11  41.91,36.73 90 top
R12  59.28,37.64 180 top
R13  41.61,39.17 0 top
RC0  35.81,31.7 0 top
RCAL  59.89,11.89 90 top
RST  10.97,7.62 180 top
SDCARD  57.15,28.5 180 top
SPI  22.86,41.45 0 top
TP1  27.23,34.49 0 top
TP2  13.87,9.19 0 top
TP3  30.53,7.67 0 top
TP4  30.58,9.35 0 top
UART  18.29,41.45 180 top
USB  25.86,4.17 0 top
VB  36.42,28.5 0 top
VCAP  40.39,13.11 0 top
VZ  32.61,28.5 0 top
XTAL  32,31.7 180 top

### Tracks (layer width: path | path; a pad name or v marks a point on that pad's centre or on a via)
3.3V
  pour Top: 8.23,44.35 62.64,44.35 62.64,-0.3 62.79,-0.46 8.23,-0.46
AFE1
  Top 0.254: AD5941.34 40.97,17.14 41.3,16.81 51.31,16.81 PERIPHERALS.4
AFE2
  Top 0.254: AD5941.35 41.47,17.29 41.54,17.22 52.17,17.22 PERIPHERALS.3
AFE.RST  (via drill 0.35)
  Top 0.152: ESP32.18 28.07,20.7 28.98,19.79 33.96,19.79 v33.98,19.81 35.75,19.81 AD5941.22
  Bottom 0.152: v33.98,19.81 33.38,19.2 33.38,14.78 GPIOS/RST.4
AIN3
  Top 0.254: AD5941.36 41.97,17.79 42.08,17.68 51.56,17.68 PERIPHERALS.2
AIN4
  Top 0.254: AD5941.40 43.11,20.29 44.4,18.99 51.61,18.99 PERIPHERALS.1
AVDD.REG
  Top 0.152: C12.1 40.69,27.39 40.69,27.02 39.93,26.25 39.93,25.02 AD5941.5
BIAS.0
  Top 0.152: AD5941.8 38.47,25.84 36.92,27.39 | 36.92,27.39 C14.1 | 36.92,27.39 36.42,27.89 VB.P$1
BIAS.CAP
  Top 0.152: AD5941.31 39.47,17.79 39.62,17.63 39.62,15.66 C10.1 40.39,14.89 VCAP.P$1
BOOT  (via drill 0.35)
  Top 0.152: TP1.P$1 25.96,34.49 v25.91,34.44 26.24,34.11 ESP32.27 | v16.15,34.9 12.94,34.9 BOOT.4 BOOT.3
  Bottom 0.152: v25.91,34.44 25.45,34.9 v16.15,34.9
CD1
  Top 0.254: SDCARD.CD1 55.32,29.11 R6.2
CD2
  Top 0.254: R7.2 50.84,30.63 SDCARD.CD2
CE  (via drill 0.35)
  Top 0.254: AD5941.47 45.4,23.79 v45.41,23.77
  Bottom 0.254: v45.41,23.77 45.46,23.73 59.23,23.73 ELECTRODES.2
CS.AFE
  Top 0.152: AD5941.15 35.74,23.32 30.94,23.32 | ESP32.19 29.59,21.97 30.94,23.32 | 30.94,23.32 30.94,24.23 CS.TP
CS.SD  (via drill 0.35)
  Top 0.152: ESP32.23 26.14,27.05 26.06,27.13 v26.06,31.09 | SDCARD.2 49.22,38.71 49.22,37.64 48.96,37.38 R11.2 41.87,37.34 v40.08,37.34
  Bottom 0.152: v40.08,37.34 32.31,37.34 v26.06,31.09
CS.SPI  (via drill 0.35)
  Top 0.152: ESP32.31 21.16,35.94 v21.18,35.97
  Bottom 0.152: v21.18,35.97 21.18,39.78 SPI.1
DAT1
  Top 0.254: SDCARD.8 55.85,37.72 56.08,37.49 58.48,37.49 R12.2
DAT2
  Top 0.254: SDCARD.1 42.6,39.14 R13.2
DE  (via drill 0.35)
  Top 0.254: AD5941.46 v44.8,23.29 v44.81,23.29
  Bottom 0.254: v44.81,23.29 45.04,23.29 45.05,23.27 57.14,23.27 ELECTRODES.3
DVDD.1V8
  Top 0.152: AD5941.14 34.77,23.79 C8.1
GND  (via drill 0.35)
  Top 0.152: C8.2 v31.85,24.23 | C18.2 v31.7,25.91 | C14.2 34.75,29.3 v34.75,29.87 | C10.2 41.65,14.06 41.61,14.02 v41.61,13.87 | C11.2 v48.01,21.64 | C12.2 v40.84,29.87 | C9.2 v42.22,29.87 | BOOT.2 BOOT.1 10.15,36.95 PWR.C
  Top 0.254: R4.2 32,1.54 v32,0.73 | C3.2 v33.98,1.18 | C2.2 v42.98,6.55 | AD5941.44 43.74,22.29 v43.89,22.14 | v44.81,20.88 44.39,21.29 AD5941.42 39.47,21.29 AD5941.49 | AD5941.49 39.06,21.69 39.06,21.84 36.51,19.29 AD5941.23 34.83,19.29 v34.75,19.2 | AD5941.49 36.47,24.29 AD5941.13 35.47,24.29 35.36,24.4 v35.36,24.99 | LDO.2 37.34,5.98 v37.34,4.72 | IC1.2 40.79,8.48 v41,8.69 | R2.1 42.94,1.33 v42.98,1.37 | C4.2 v32.61,8.53 | SDCARD.6 53.65,37.94 v53.95,37.64 | C17.2 v57.76,39.47 | C19.2 58.63,41.8 v58.52,41.91 | C1.2 14.98,10.25 v14.93,10.21 | SDCARD.MT2 42.25,42.94 v42.22,42.98 | SDCARD.MT1 57.69,42.98 v58.22,42.98 | v38.1,16.76 38.47,17.13 AD5941.29 38.46,18.1 38.46,18.44 39.22,19.2 AD5941.49 | C13.2 36.88,13.72 v36.73,13.56 | C16.2 38.86,13.72 v38.71,13.56 | v35.05,17.98 35.16,18.09 AD5941.25 36.47,18.45 39.22,21.2 AD5941.49 | C15.2 v39.32,29.57 | PWR.C 10.04,37.64 v8.94,37.64 | C6.2 v9.6,9.6 | C7.2 v10.97,9.6 | C5.2 v12.34,9.6 | RST.2 RST.1 12.65,6.72 v12.65,5.79 | ESP32.41_3 ESP32.41_12 ESP32.41_9 ESP32.41_17 ESP32.41_8 | ESP32.41_3 ESP32.41_15 ESP32.41_6 ESP32.41_21 ESP32.41_5 | ESP32.41_5 ESP32.41_14 ESP32.41_1 | ESP32.41_5 ESP32.41_20 ESP32.41_4 ESP32.41_13 ESP32.41_2 | ESP32.41_2 ESP32.41_18 ESP32.41_1 | ESP32.41_2 ESP32.41_11 ESP32.41_7 ESP32.41_16 ESP32.41_8 | ESP32.41_8 ESP32.41_10 ESP32.41_1 | ESP32.41_1 ESP32.41_19 ESP32.41_3 | ESP32.1 9.73,16.58 v9.75,16.61 | ESP32.40 9.75,32.6 v9.75,31.09 | LIPO1.1 49.88,8.38 v50.14,8.38 | USB.5 27.16,5.36 v27.28,5.49
  pour Bottom: 8.23,44.35 62.79,44.35 62.79,-0.61 8.23,-0.61
GPIO.0  (via drill 0.35)
  Top 0.152: AD5941.19 v31.8,21.29 | v30.17,18.9 29.95,19.13 27.79,19.13 ESP32.17
  Bottom 0.152: v31.8,21.29 30.17,19.66 v30.17,18.9 GPIOS/RST.1
GPIO.1  (via drill 0.35)
  Top 0.152: AD5941.20 32.52,20.79 v32.46,20.73
  Bottom 0.152: v32.46,20.73 31.6,19.86 31.6,14.32 GPIOS/RST.2
GPIO.2  (via drill 0.35)
  Top 0.152: AD5941.21 33.22,20.29 v33.22,20.27
  Bottom 0.152: v33.22,20.27 32.46,19.51 32.46,14.43 GPIOS/RST.3
MCU.RST
  Top 0.254: ESP32.3 12.27,14.86 13.68,13.45 R1.2 C1.1 13.68,9.39 TP2.P$1 13.12,8.45 RST.3 RST.4
MISO  (via drill 0.35)
  Top 0.152: R8.2 58.58,36.37 55.53,36.37 54.75,37.15 SDCARD.7 54.75,40.5 53.8,41.45 36.12,41.45 33.83,43.74 26.98,43.74 25.4,42.16 SPI.2 | v22.4,35.97 22.43,35.94 ESP32.30 22.43,21.62 v23.62,20.42 | AD5941.18 31.09,21.79 v29.72,20.42
  Bottom 0.152: v22.4,35.97 22.4,38.45 SPI.2 | v23.62,20.42 v29.72,20.42
MOSI  (via drill 0.35)
  Top 0.152: v32.77,40.23 32.77,40.54 31.85,41.45 SPI.4 | SDCARD.3 49.37,40.12 38.41,40.12 R9.2 37.14,39.97 v37.03,40.08 | v25.3,35.97 24.97,35.63 ESP32.28 24.97,23.65 v25.3,23.32 | v31.55,22.28 31.52,22.25 31.47,22.25 31.5,22.29 AD5941.17
  Bottom 0.152: v37.03,40.08 32.92,40.08 v32.77,40.23 | v25.3,35.97 25.3,36.27 SPI.4 | v31.55,22.28 31.39,22.25 30.33,23.32 v25.3,23.32
N$1
  Top 0.254: 40.36,1.31 R3.1
  Top 0.305: CHRG.C 40.36,1.31
N$2
  Top 0.254: R3.2 40.39,2.78 40.84,3.24 40.84,5.49 41.76,6.4 41.76,7.28 IC1.1
N$3
  Top 0.254: R2.2 41.91,4.53 IC1.5
N$4
  Top 0.254: R5.1 11.47,37.97 PWR.A
N$7
  Top 0.254: D1.C 34.03,3.59 C3.1 33.98,4.88 Q1.2 | LDO.3 38.24,4.56 37.8,4.12 36.88,4.12 36.34,4.66 LDO.1 34.9,6.03 Q1.2 | Q1.2 33.87,5.3 33.22,5.94 31.85,5.94 30.53,7.26 TP3.P$1
RC0.0  (via drill 0.35)
  Top 0.254: AD5941.3 40.97,25.57 v42.06,26.67
  Bottom 0.254: v42.06,26.67 40.84,27.89 37.95,27.89 35.81,30.02 RC0.1
RC0.1  (via drill 0.35)
  Top 0.254: v43.43,26.06 42.19,26.06 41.47,25.34 AD5941.2
  Bottom 0.254: v43.43,26.06 41,28.5 38.25,28.5 37.06,29.69 37.06,31.42 37.08,31.45 RC0.2
RCAL0  (via drill 0.35)
  Top 0.254: AD5941.32 39.97,16.67 40.78,15.85 46.02,15.85 v46.48,15.39
  Bottom 0.254: v46.48,15.39 48.92,12.95 58.83,12.95 RCAL.1
RCAL1  (via drill 0.35)
  Top 0.254: AD5941.33 40.46,18.09 40.46,16.84 41,16.31 46.79,16.31 v46.94,16.15
  Bottom 0.254: v46.94,16.15 49.38,13.72 59.18,13.72 RCAL.2
RE  (via drill 0.35)
  Top 0.254: AD5941.48 46.12,24.29 v46.18,24.23
  Bottom 0.254: ELECTRODES.1 58.52,24.23 v46.18,24.23
REF.1V8
  Top 0.152: AD5941.43 43.59,21.79 43.74,21.64 C11.1
REF.2V5
  Top 0.152: AD5941.4 40.47,26.13 42.11,27.54 C9.1 43.78,27.54 2V5.P$1
RX  (via drill 0.35)
  Top 0.254: ESP32.36 14.81,33.86 v15.09,34.14
  Bottom 0.254: v15.09,34.14 15.09,40.79 UART.2
SCL/7/CH1  (via drill 0.35)
  Top 0.254: ESP32.7 17.35,13.69 v17.22,13.56
  Bottom 0.254: v17.22,13.56 17.22,3.91 I2C.3
SCLK  (via drill 0.35)
  Top 0.152: AD5941.16 31.17,22.79 v29.87,21.49 | SPI.3 27.94,42.11 28.96,43.13 v32,43.13 | SDCARD.5 52.58,39.17 52.58,40.08 51.82,40.84 34.86,40.84 R10.2 33.79,40.73 v33.68,40.84 | v23.62,21.95 23.62,32.55 ESP32.29 23.7,35.89 v23.77,35.97
  Bottom 0.152: v29.87,21.49 29.41,21.03 24.54,21.03 v23.62,21.95 | v23.77,35.97 23.77,37.64 27.58,41.45 SPI.3 | v33.68,40.84 33.68,41.45 v32,43.13
SDA/6/CH0  (via drill 0.35)
  Top 0.254: ESP32.6 16.08,13.64 v16,13.56
  Bottom 0.254: v16,13.56 16,5.23 I2C.2
TX  (via drill 0.35)
  Top 0.254: ESP32.37 13.54,33.8 v14.02,34.29
  Bottom 0.254: v14.02,34.29 14.02,40.64 UART.3
USB_N  (via drill 0.35)
  Top 0.152: USB.2 25.21,5.39 v25.3,5.49 | v25.15,13.56 25.15,14.95 ESP32.13
  Bottom 0.152: v25.3,5.49 25.3,13.41 v25.15,13.56
USB_P  (via drill 0.35)
  Top 0.152: USB.3 25.86,5.39 v25.95,5.49 | v25.91,13.56 25.91,14.8 ESP32.14
  Bottom 0.152: v25.95,5.49 25.95,13.52 v25.91,13.56
V_USB
  Top 0.254: USB.1 24.56,3.18 24.84,2.9 31.36,2.9 R4.1 | R4.1 31.97,3.51 Q1.1 | R4.1 32.42,3.39 33.07,2.74 33.07,1.07 33.68,0.46 34.83,0.46 D1.A 35.73,1.29 37.5,3.06 CHRG.A 39.84,4.55 IC1.4
VLIPO
  Top 0.254: IC1.3 39.78,7.29 | 39.78,7.29 33.12,7.29 Q1.3 | LIPO1.2 45.33,8.88 C2.1 42.41,9.45 40.39,9.45 39.78,8.84 39.78,7.29
WE  (via drill 0.35)
  Top 0.254: AD5941.45 v44.04,22.79
  Bottom 0.254: v44.04,22.79 44.14,22.79 55.09,22.79 ELECTRODES.4
XTAL.I  (via drill 0.35)
  Top 0.254: AD5941.11 36.97,25.36 36.58,25.75 v36.58,25.91
  Bottom 0.254: XTAL.1 32,30.48 v36.58,25.91
XTAL.O  (via drill 0.35)
  Top 0.254: AD5941.12 35.6,25.85 v35.66,25.91
  Bottom 0.254: v35.66,25.91 30.84,30.73 30.84,31.7 XTAL.2
ZERO.0
  Top 0.152: AD5941.9 37.97,25.73 37.19,26.52 34.63,26.52 C18.1 32.61,27.32 VZ.P$1

### Text on the board
tPlace: GND | TX | RX | 3V3 | 38 | MO | SCLK | MI | BOOT | 0 | 1 | VZ | VB | 2V5 | RE | CE | DE | AIN | 4 | 3 | 2 | WE | AFE | 1 | 0 | 1 | 2 | RST | VCAP | 3V3 | SDA | SCL | GND | 6 | 7